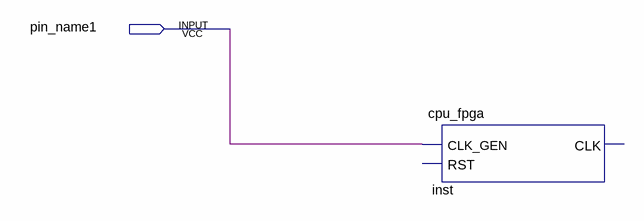
[diagram p0: schematic sheet]
// Quartus schematic TopLevel.bdf as structural Verilog: 1 symbols, 1 pins
module TopLevel (
  input  pin_name1
);

  cpu_fpga inst (.CLK_GEN(pin_name1));  // open: RST, CLK
endmodule
